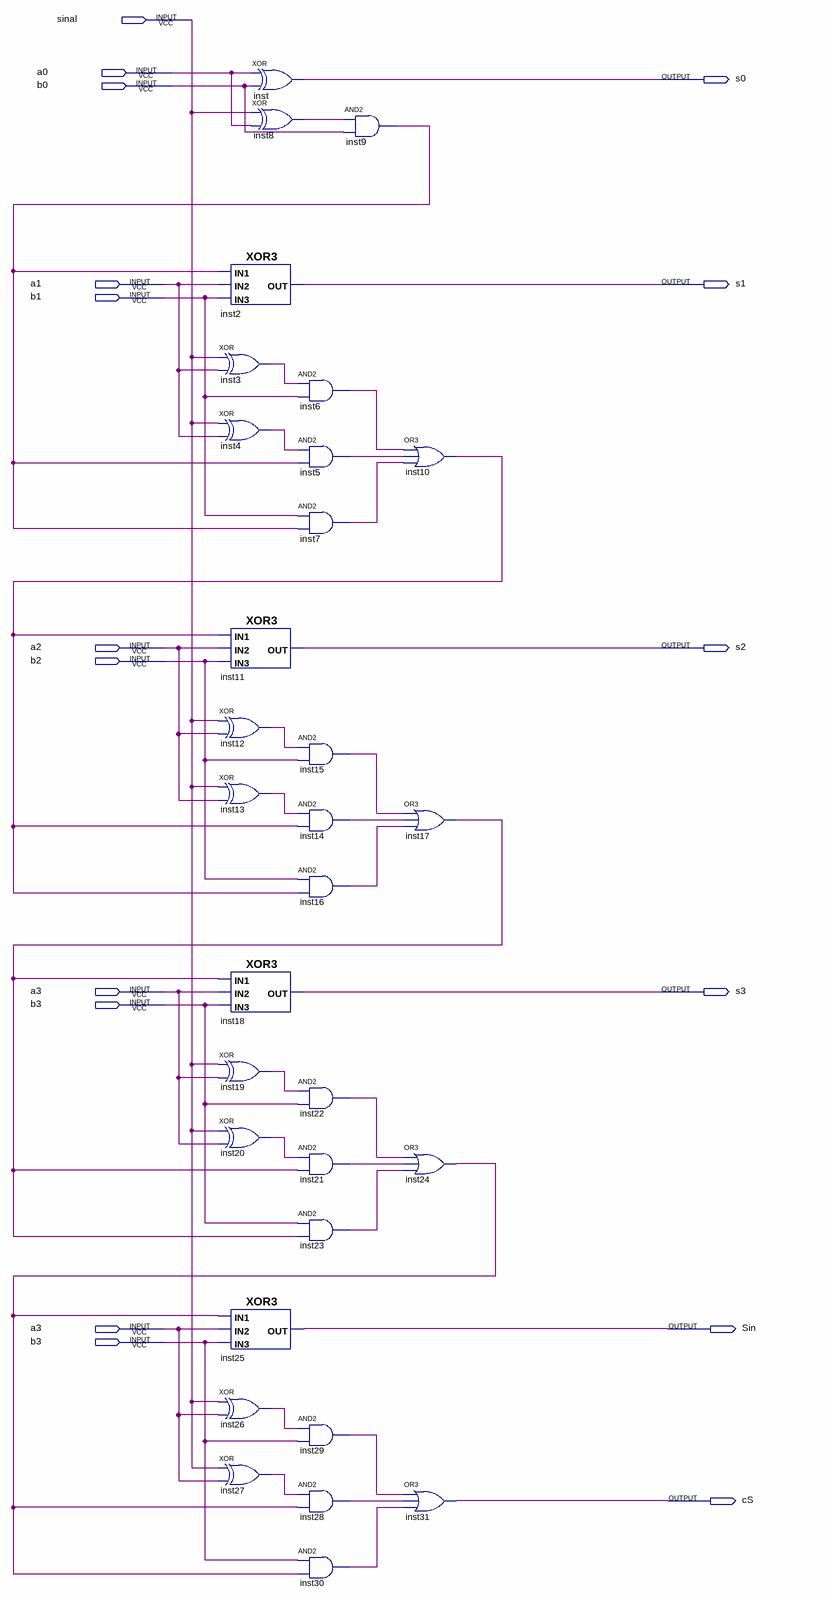
[diagram p0: schematic sheet]
// Quartus schematic somsub.bdf as structural Verilog: 31 symbols, 17 pins
module somsub (
  input  sinal,
  input  a0,
  input  b0,
  input  a1,
  input  b1,
  input  a2,
  input  b2,
  input  a3,
  input  b3,
  output s0,
  output s1,
  output s2,
  output s3,
  output Sin,
  output cS
);

  wire inst3_out, inst4_out, inst5_out, inst6_out, inst7_out, inst8_out, inst9_out, inst10_out, inst12_out,
       inst13_out, inst14_out, inst15_out, inst16_out, inst17_out, inst19_out, inst20_out, inst21_out,
       inst22_out, inst23_out, inst24_out, inst26_out, inst27_out, inst28_out, inst29_out, inst30_out;

  XOR3 inst2 (.IN3(b1), .IN1(inst9_out), .IN2(a1), .OUT(s1));
  xor inst3 (inst3_out, sinal, a1);
  xor inst4 (inst4_out, sinal, a1);
  XOR3 inst11 (.IN3(b2), .IN1(inst10_out), .IN2(a2), .OUT(s2));
  xor inst12 (inst12_out, sinal, a2);
  xor inst13 (inst13_out, sinal, a2);
  XOR3 inst18 (.IN3(b3), .IN1(inst17_out), .IN2(a3), .OUT(s3));
  xor inst19 (inst19_out, sinal, a3);
  xor inst20 (inst20_out, sinal, a3);
  XOR3 inst25 (.IN3(b3), .IN1(inst24_out), .IN2(a3), .OUT(Sin));
  xor inst26 (inst26_out, sinal, a3);
  xor inst27 (inst27_out, sinal, a3);
  xor inst (s0, a0, b0);
  xor inst8 (inst8_out, sinal, a0);
  and inst6 (inst6_out, inst3_out, b1);
  and inst5 (inst5_out, inst4_out, inst9_out);
  and inst7 (inst7_out, b1, inst9_out);
  and inst15 (inst15_out, inst12_out, b2);
  and inst14 (inst14_out, inst13_out, inst10_out);
  and inst16 (inst16_out, b2, inst10_out);
  and inst22 (inst22_out, inst19_out, b3);
  and inst21 (inst21_out, inst20_out, inst17_out);
  and inst23 (inst23_out, b3, inst17_out);
  and inst29 (inst29_out, inst26_out, b3);
  and inst28 (inst28_out, inst27_out, inst24_out);
  and inst30 (inst30_out, b3, inst24_out);
  and inst9 (inst9_out, inst8_out, b0);
  or inst10 (inst10_out, inst6_out, inst5_out, inst7_out);
  or inst17 (inst17_out, inst15_out, inst14_out, inst16_out);
  or inst24 (inst24_out, inst22_out, inst21_out, inst23_out);
  or inst31 (cS, inst29_out, inst28_out, inst30_out);
endmodule
